# Altium project ELoad Control Assembly Gen 2 Rev 2.PrjPcb
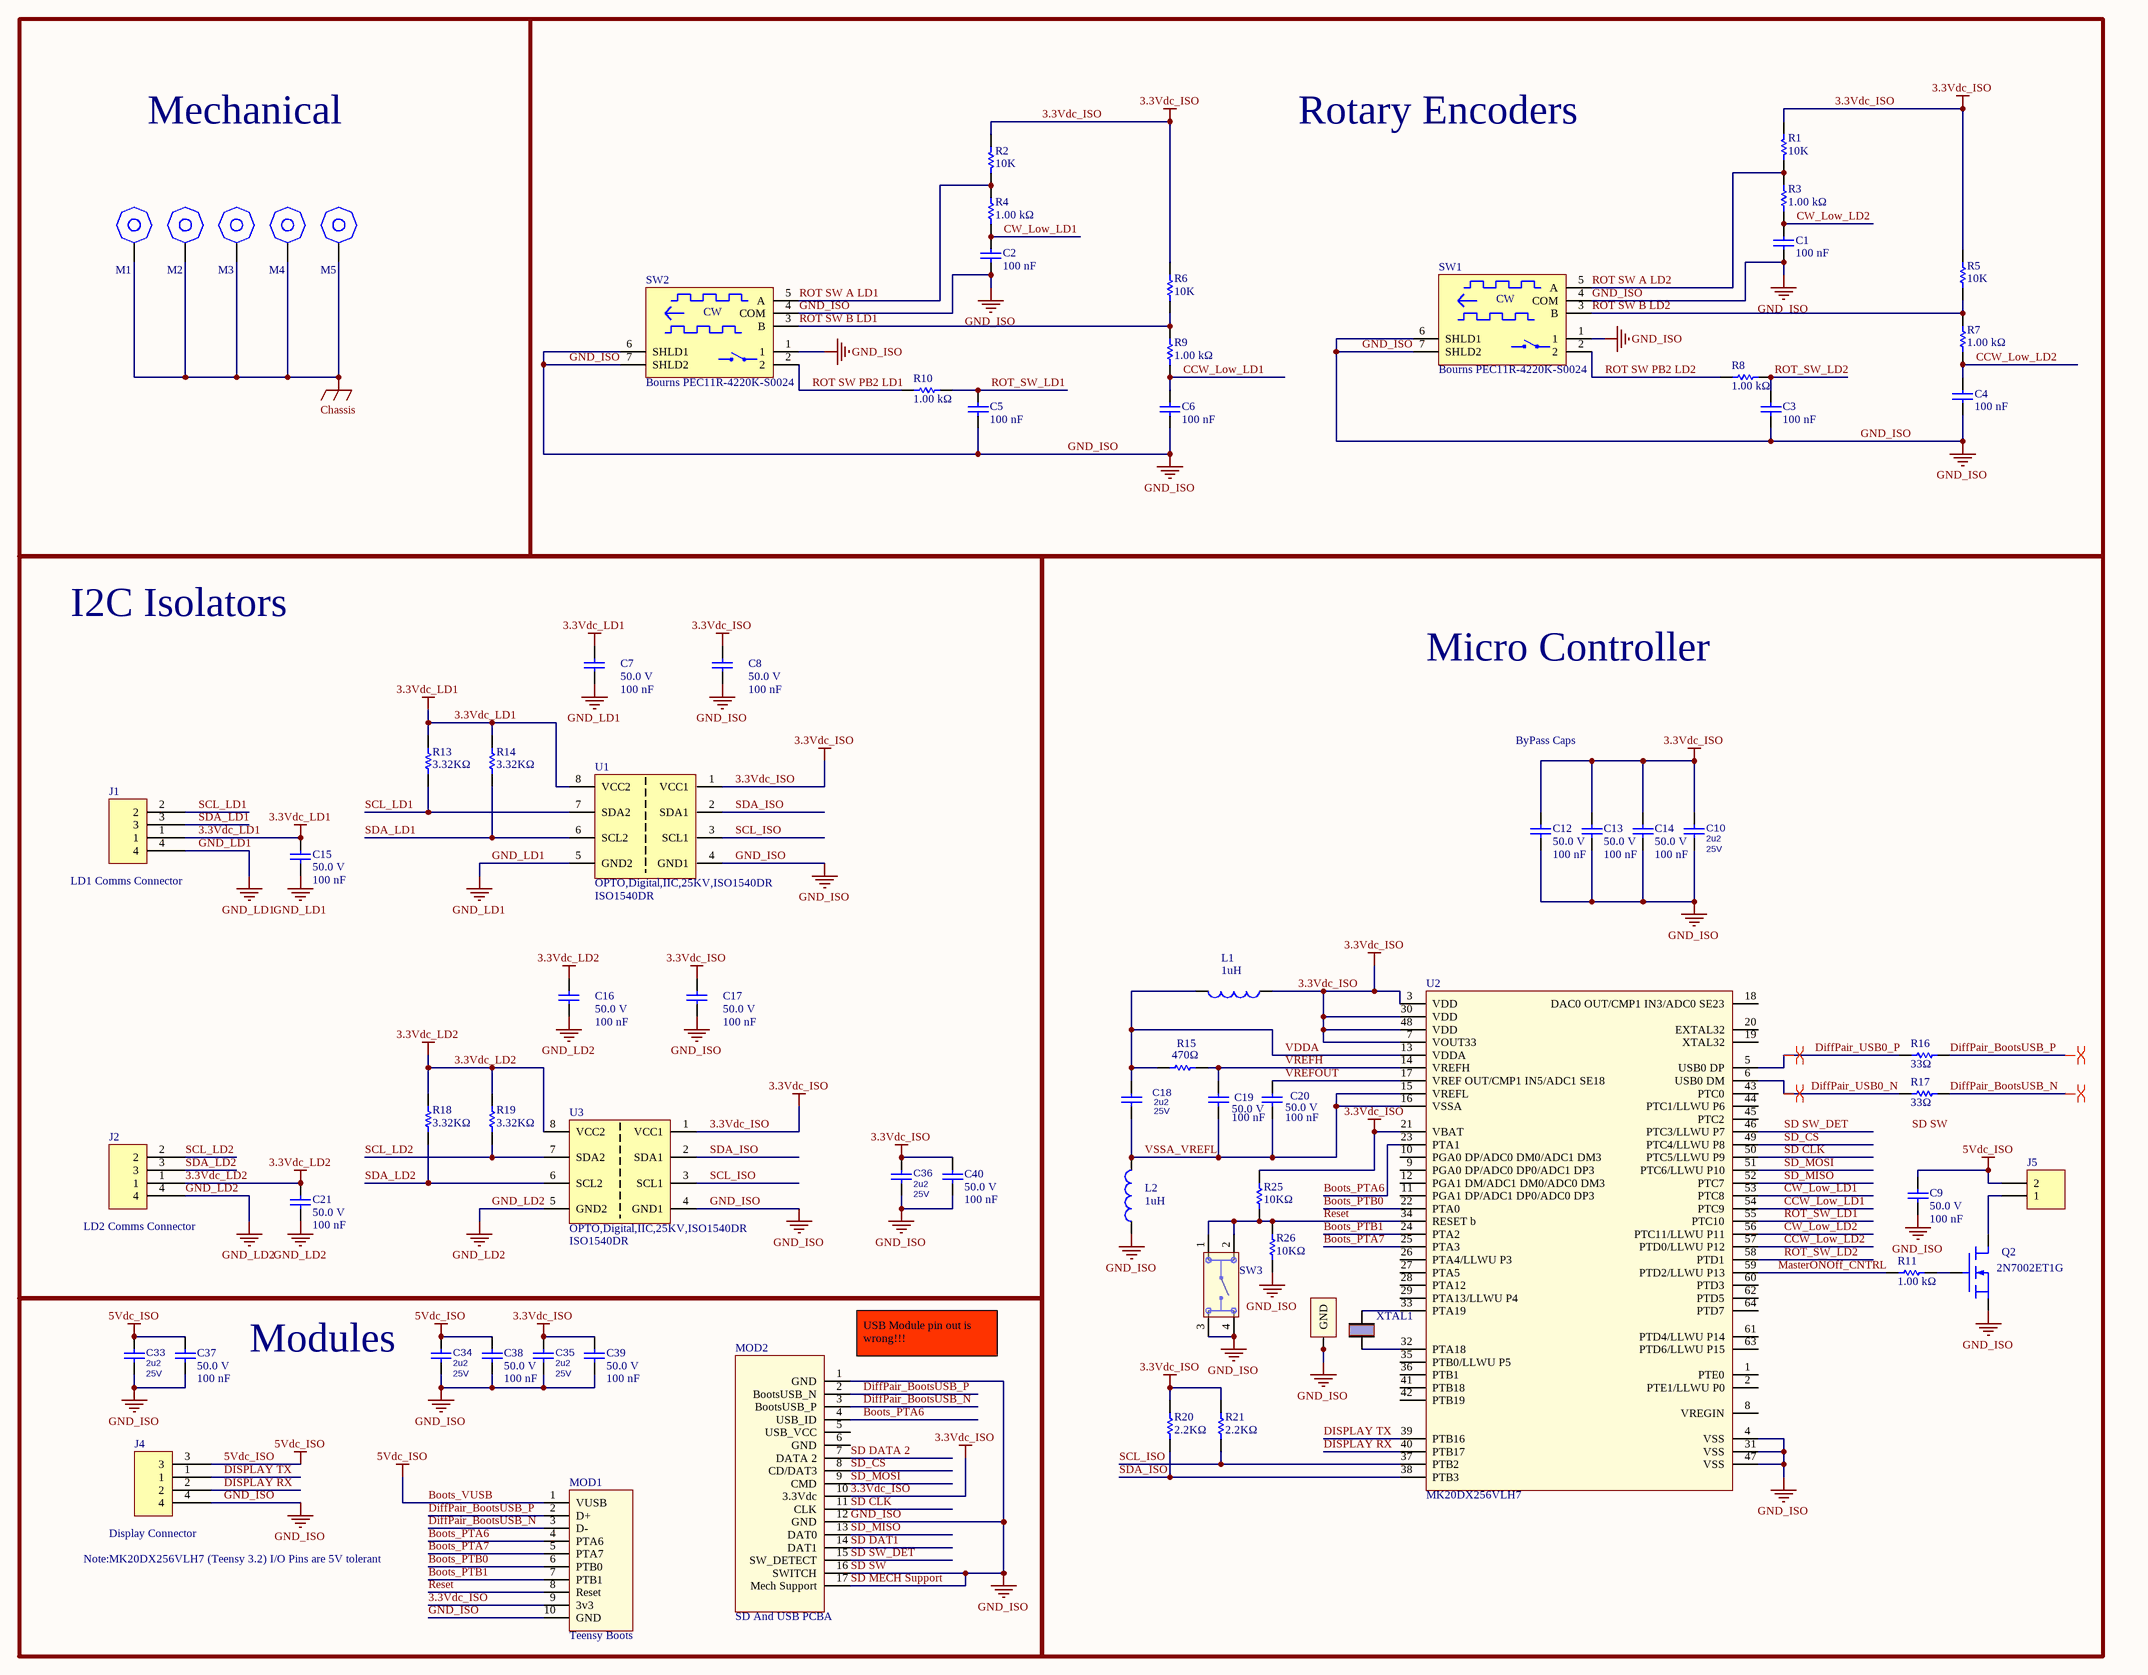
[diagram p0: ELoad Control Assembly Gen 2 - Rev 2.SchDoc]
3 sheets, 89 parts. Net scope: global (net labels, ports and power ports of the same name join across sheets).
Sheets:
  ELoad Control Assembly Gen 2 - Rev 2.SchDoc
  ELoad Control Assembly Gen 2 - Net Classes Rev 2.SchDoc
  ELoad Control Assembly Gen 2 - PSU - Rev 2.SchDoc

## Sheet ELoad Control Assembly Gen 2 - Rev 2.SchDoc
size C

### Parts
C1  Capacitance: 100 nF  [CAP, 0805, HD]  (hidden comment: 08055C104JAT2A)
C2  Capacitance: 100 nF  [CAP, 0805, HD]  (hidden comment: 08055C104JAT2A)
C3  Capacitance: 100 nF  [CAP, 0805, HD]  (hidden comment: 08055C104JAT2A)
C4  Capacitance: 100 nF  [CAP, 0805, HD]  (hidden comment: 08055C104JAT2A)
C5  Capacitance: 100 nF  [CAP, 0805, HD]  (hidden comment: 08055C104JAT2A)
C6  Capacitance: 100 nF  [CAP, 0805, HD]  (hidden comment: 08055C104JAT2A)
C7  Voltage Rating (DC): 50.0 V  Capacitance: 100 nF  [Cap,0805]  (hidden comment: Cap)
C8  Voltage Rating (DC): 50.0 V  Capacitance: 100 nF  [Cap,0805]  (hidden comment: Cap)
C9  Voltage Rating (DC): 50.0 V  Capacitance: 100 nF  [Cap,0805]  (hidden comment: Cap)
C10  2u2  Voltage: 25V  [CAP, 0805, HD]  (net tie)
C12  Voltage Rating (DC): 50.0 V  Capacitance: 100 nF  [Cap,0805]  (hidden comment: Cap)
C13  Voltage Rating (DC): 50.0 V  Capacitance: 100 nF  [Cap,0805]  (hidden comment: Cap)
C14  Voltage Rating (DC): 50.0 V  Capacitance: 100 nF  [Cap,0805]  (hidden comment: Cap)
C15  Voltage Rating (DC): 50.0 V  Capacitance: 100 nF  [Cap,0805]  (hidden comment: Cap)
C16  Voltage Rating (DC): 50.0 V  Capacitance: 100 nF  [Cap,0805]  (hidden comment: Cap)
C17  Voltage Rating (DC): 50.0 V  Capacitance: 100 nF  [Cap,0805]  (hidden comment: Cap)
C18  2u2  Voltage: 25V  [res, 0805, HD]  (net tie)
C19  Voltage Rating (DC): 50.0 V  Capacitance: 100 nF  [Cap,0805]  (hidden comment: Cap)
C20  Voltage Rating (DC): 50.0 V  Capacitance: 100 nF  [Cap,0805]  (hidden comment: Cap)
C21  Voltage Rating (DC): 50.0 V  Capacitance: 100 nF  [Cap,0805]  (hidden comment: Cap)
C33  2u2  Voltage: 25V  [CAP, 0805, HD]  (net tie)
C34  2u2  Voltage: 25V  [CAP, 0805, HD]  (net tie)
C35  2u2  Voltage: 25V  [CAP, 0805, HD]  (net tie)
C36  2u2  Voltage: 25V  [CAP, 0805, HD]  (net tie)
C37  Voltage Rating (DC): 50.0 V  Capacitance: 100 nF  [Cap,0805]  (hidden comment: Cap)
C38  Voltage Rating (DC): 50.0 V  Capacitance: 100 nF  [Cap,0805]  (hidden comment: Cap)
C39  Voltage Rating (DC): 50.0 V  Capacitance: 100 nF  [Cap,0805]  (hidden comment: Cap)
C40  Voltage Rating (DC): 50.0 V  Capacitance: 100 nF  [Cap,0805]  (hidden comment: Cap)
J1  JST B4B-PH-K-S(LF)(SN)  [Conn, JST, 4 pin, 2mm spacing Right Angle]  (value not drawn)
J2  JST B4B-PH-K-S(LF)(SN)  [Conn, JST, 4 pin, 2mm spacing Right Angle]  (value not drawn)
J4  JST B4B-PH-K-S(LF)(SN)  [Conn, JST, 4 pin, 2mm spacing Right Angle]  (value not drawn)
J5  conn, through hole, molex, 2 pin, 0.1",640456-2  [Conn, Molex, 2pin,0.1" spacing]  (value not drawn)
L1  Inductance: 1uH  [Ind, 0805]  (hidden comment: BK2125HM601-T)
L2  Inductance: 1uH  [Ind, 0805]  (hidden comment: BK2125HM601-T)
M1  M3 hex Standoff  [Standoff,Hex,M3,8mm]  (value not drawn)
M2  M3 hex Standoff  [Standoff,Hex,M3,8mm]  (value not drawn)
M3  M3 hex Standoff  [Standoff,Hex,M3,8mm]  (value not drawn)
M4  M3 hex Standoff  [Standoff,Hex,M3,8mm]  (value not drawn)
M5  M3 hex Standoff  [Standoff,Hex,M3,8mm]  (value not drawn)
MOD1  Teensy Boots  [Mod,Teensy Boots]
MOD2  Discription: SD And USB PCBA  [Mod, SD and USB Connector Breakout - duplicate]  (hidden comment: SD Card Connector Breakout)
Q2  2N7002ET1G  [SOT23-3]
R1  Resistance: 10K  [res, 0805, HD]  (hidden comment: Vishay / Dale CRCW080510K0FKTA)
R2  Resistance: 10K  [res, 0805, HD]  (hidden comment: Vishay / Dale CRCW080510K0FKTA)
R3  Resistance: 1.00 kΩ  [res, 0805, HD]  (hidden comment: Vishay CRCW08051K00JNEA)
R4  Resistance: 1.00 kΩ  [res, 0805, HD]  (hidden comment: Vishay CRCW08051K00JNEA)
R5  Resistance: 10K  [res, 0805, HD]  (hidden comment: Vishay / Dale CRCW080510K0FKTA)
R6  Resistance: 10K  [res, 0805, HD]  (hidden comment: Vishay / Dale CRCW080510K0FKTA)
R7  Resistance: 1.00 kΩ  [res, 0805, HD]  (hidden comment: Vishay CRCW08051K00JNEA)
R8  Resistance: 1.00 kΩ  [res, 0805, HD]  (hidden comment: Vishay CRCW08051K00JNEA)
R9  Resistance: 1.00 kΩ  [res, 0805, HD]  (hidden comment: Vishay CRCW08051K00JNEA)
R10  Resistance: 1.00 kΩ  [res, 0805, HD]  (hidden comment: Vishay CRCW08051K00JNEA)
R11  Resistance: 1.00 kΩ  [res, 0805, HD]  (hidden comment: Vishay CRCW08051K00JNEA)
R13  Resistance: 3.32KΩ  [res, 0805, HD]  (hidden comment: Res1)
R14  Resistance: 3.32KΩ  [res, 0805, HD]  (hidden comment: Res1)
R15  Resistance: 470Ω  [res, 0805, HD]  (hidden comment: Res1)
R16  Resistance: 33Ω  [res, 0805, HD]  (hidden comment: CR0805-JW-330ELF)
R17  Resistance: 33Ω  [res, 0805, HD]  (hidden comment: CR0805-JW-330ELF)
R18  Resistance: 3.32KΩ  [res, 0805, HD]  (hidden comment: Res1)
R19  Resistance: 3.32KΩ  [res, 0805, HD]  (hidden comment: Res1)
R20  Resistance: 2.2KΩ  [res, 0805, HD]  (hidden comment: Res1)
R21  Resistance: 2.2KΩ  [res, 0805, HD]  (hidden comment: Res1)
R25  Resistance: 10KΩ  [res, 0805, HD]  (hidden comment: Vishay / Dale CRCW080510K0FKTA)
R26  Resistance: 10KΩ  [res, 0805, HD]  (hidden comment: Vishay / Dale CRCW080510K0FKTA)
SW1  Bourns PEC11R-4220K-S0024  [Rotary encoder]
SW2  Bourns PEC11R-4220K-S0024  [Rotary encoder]
SW3  Switch, push button,N.O. DPST,SKRPACE010  [Switch Tactile N.O. SPST Button]  (value not drawn)
U1  OPTO,Digital,IIC,25KV,ISO1540DR  Manufacturer Part Number 1: ISO1540DR  [SOIC-8]
U2  MK20DX256VLH7  [LQFP-64]
U3  OPTO,Digital,IIC,25KV,ISO1540DR  Manufacturer Part Number 1: ISO1540DR  [SOIC-8]
XTAL1  NX3225SA-16.000000MHZ-B3  [CRYSTAL,4-SMD, No Lead]  (value not drawn)

### Blocks framed on the sheet
Mechanical: M1-M5
Rotary Encoders: C1-C6 R1-R10 SW1 SW2
I2C Isolators: C7 C8 C15-C17 C21 C36 C40 J1 J2 R13 R14 R18 R19 U1 U3
Micro Controller: C9 C10 C12-C14 C18-C20 J5 L1 L2 Q2 R11 R15-R17 R20 R21 R25 R26 SW3 U2 XTAL1
Modules: C33-C35 C37-C39 J4 MOD1 MOD2

### Nets
3.3Vdc_ISO: C8.2 C10.2 C12.2 C13.2 C14.2 C17.2 C35.2 C36.2 C39.2 C40.2 L1.1 MOD1.9(3v3) MOD2.10(3.3Vdc) R1.2 R2.2 R5.1 R6.1 R20.2 R21.2 R25.2 U1.1(VCC1) U2.3(VDD) U2.7(VOUT33) U2.21(VBAT) U2.30(VDD) U2.48(VDD) U3.1(VCC1)
3.3Vdc_LD1: C7.2 C15.2 J1.1 R13.2 R14.2 U1.8(VCC2)
3.3Vdc_LD2: C16.2 C21.2 J2.1 R18.2 R19.2 U3.8(VCC2)
5Vdc_ISO: C9.2 C33.2 C34.2 C37.2 C38.2 J4.3 J5.2 MOD1.1(VUSB)  [also labelled Boots_VUSB]
Chassis: M1.0 M2.0 M3.0 M4.0 M5.0
GND_ISO: C1.1 C2.1 C3.1 C4.1 C5.1 C6.1 C8.1 C9.1 C10.1 C12.1 C13.1 C14.1 C17.1 C33.1 C34.1 C35.1 C36.1 C37.1 C38.1 C39.1 C40.1 J4.4 L2.1 MOD1.10(GND) MOD2.1(GND) MOD2.12(GND) MOD2.16(SWITCH) MOD2.17(Mech_Support) Q2.2(S) R26.1 SW1.1 SW1.4(COM) SW1.6(SHLD1) SW1.7(SHLD2) SW2.1 SW2.4(COM) SW2.6(SHLD1) SW2.7(SHLD2) SW3.3 SW3.4 U1.4(GND1) U2.4(VSS) U2.31(VSS) U2.47(VSS) U3.4(GND1) XTAL1.2(GND) XTAL1.4  [also labelled SD MECH Support, SD SW]
GND_LD1: C7.1 C15.1 J1.4 U1.5(GND2)
GND_LD2: C16.1 C21.1 J2.4 U3.5(GND2)
Boots_PTA6: MOD1.4(PTA6) MOD2.4(USB_ID) U2.23(PTA1)
Boots_PTA7: MOD1.5(PTA7) U2.25(PTA3)
Boots_PTB0: MOD1.6(PTB0) U2.22(PTA0)
Boots_PTB1: MOD1.7(PTB1) U2.24(PTA2)
CCW_Low_LD1: C6.2 R9.2 U2.54(PTC9)
CCW_Low_LD2: C4.2 R7.2 U2.57(PTD0/LLWU_P12)
CW_Low_LD1: C2.2 R4.2 U2.53(PTC8)
CW_Low_LD2: C1.2 R3.2 U2.56(PTC11/LLWU_P11)
DiffPair_BootsUSB_N: MOD1.3(D-) MOD2.3(BootsUSB_P) R17.1
DiffPair_BootsUSB_P: MOD1.2(D+) MOD2.2(BootsUSB_N) R16.1
DiffPair_USB0_N: R17.2 U2.6(USB0_DM)
DiffPair_USB0_P: R16.2 U2.5(USB0_DP)
DISPLAY RX: J4.2 U2.40(PTB17)
DISPLAY TX: J4.1 U2.39(PTB16)
MasterO~{N}Off_CNTRL: R11.1 U2.59(PTD2/LLWU_P13)
Reset: MOD1.8(Reset) R25.1 R26.2 SW3.1 SW3.2 U2.34(RESET_b)
ROT SW A LD1: R2.1 R4.1 SW2.5(A)
ROT SW A LD2: R1.1 R3.1 SW1.5(A)
ROT SW B LD1: R6.2 R9.1 SW2.3(B)
ROT SW B LD2: R5.2 R7.1 SW1.3(B)
ROT SW PB2 LD1: R10.1 SW2.2
ROT SW PB2 LD2: R8.1 SW1.2
ROT_SW_LD1: C5.2 R10.2 U2.55(PTC10)
ROT_SW_LD2: C3.2 R8.2 U2.58(PTD1)
SCL_ISO: R21.1 U1.3(SCL1) U2.37(PTB2) U3.3(SCL1)
SCL_LD1: J1.2 R13.1 U1.7(SDA2)
SCL_LD2: J2.2 R19.1 U3.7(SDA2)
SD CLK: MOD2.11(CLK) U2.50(PTC5/LLWU_P9)
SD DAT1: MOD2.14(DAT1)
SD DATA 2: MOD2.7(DATA_2)
SD SW_DET: MOD2.15(SW_DETECT) U2.46(PTC3/LLWU_P7)
SD_CS: MOD2.8(CD/DAT3) U2.49(PTC4/LLWU_P8)
SD_MISO: MOD2.13(DAT0) U2.52(PTC7)
SD_MOSI: MOD2.9(CMD) U2.51(PTC6/LLWU_P10)
SDA_ISO: R20.1 U1.2(SDA1) U2.38(PTB3) U3.2(SDA1)
SDA_LD1: J1.3 R14.1 U1.6(SCL2)
SDA_LD2: J2.3 R18.1 U3.6(SCL2)
VDDA: C18.2 L1.2 R15.2 U2.13(VDDA)
VREFH: C19.2 R15.1 U2.14(VREFH)
VREFOUT: C20.2 U2.17(VREF_OUT/CMP1_IN5/ADC1_SE18)
VSSA_VREFL: C18.1 C19.1 C20.1 L2.2 U2.15(VREFL) U2.16(VSSA)
NetJ5_1: J5.1 Q2.3(D)
NetQ2_1: Q2.1(G) R11.2
NetU2_32: U2.32(PTA18) XTAL1.3
NetU2_33: U2.33(PTA19) XTAL1.1

Not connected (* = marked no-connect by the designer): MOD2 5(USB_VCC) 6(GND); U2 1(PTE0) 2(PTE1/LLWU_P0) 8(VREGIN) 9(PGA0_DP/ADC0_DP0/ADC1_DP3) 10(PGA0_DP/ADC0_DM0/ADC1_DM3) 11(PGA1_DP/ADC1_DP0/ADC0_DP3) 12(PGA1_DM/ADC1_DM0/ADC0_DM3) 18(DAC0_OUT/CMP1_IN3/ADC0_SE23) 19(XTAL32) 20(EXTAL32) 26(PTA4/LLWU_P3) 27(PTA5) 28(PTA12) 29(PTA13/LLWU_P4) 35(PTB0/LLWU_P5) 36(PTB1) 41(PTB18) 42(PTB19) 43(PTC0) 44(PTC1/LLWU_P6) 45(PTC2) 60(PTD3) 61(PTD4/LLWU_P14) 62(PTD5) 63(PTD6/LLWU_P15) 64(PTD7)

### Layout directives
differential pair: DiffPair_BootsUSB_N, DiffPair_BootsUSB_P, DiffPair_USB0_N, DiffPair_USB0_P

### Notes on the sheet
- ByPass Caps
- (near J1) LD1 Comms Connector
- (near J2) LD2 Comms Connector
- (near MOD2) USB Module pin out is wrong!!!
- (near J4) Display Connector
- Note:MK20DX256VLH7 (Teensy 3.2) I/O Pins are 5V tolerant
- Labels drawn without touching a wire or pin: SD SW
- (in symbol Rotary encoder, PEC11R-4220K-S0024) CW

### Library data of the parts
C1-C6 = Cap,0805,100nf,50V,5%,08055C104JAT2A: Capacitor; Ceramic; Cap 0.1 uF; Tol 5%; Vol-Rtg 50 VDC; SMT; 0805; X7R; Tape & Reel; Lead-Free Status: Lead Free; Voltage Rating (DC): 50.0 V; Case/Package (SI): 2012; Insulation Resistance: 100 GΩ; Detailed Description: 0.1µF ±5% 50V Ceramic Capacitor X7R 0805 (2012 Metric); Mounting Style: Surface Mount; Packaging: Tape & Reel (TR), Cut Tape (CT); RoHS: Compliant; Size-Width: 1.24 mm; Case/Package: 0805; Number of Pins: 2; digikey url: http://www.digikey.ca/product-detail/en/avx-corporation/08055C104JAT2A/478-3352-1-ND/930144; REACH SVHC Compliance: No SVHC; Dielectric Characteristic: X7R; Capacitance Tolerance: ±5%; Size-Length: 2.01 mm; Size-Height: 710 µm; Size-Thickness: 940 µm; Manufacturer Part Number: 08055C104JAT2A; Octopart URL: http://octopart.com/08055c104jat2a-avx-55388010; Operating Temperature: -55°C ~ 125°C
C7-C9 C12-C17 C19-C21 C37-C40 = Cap,0805,100nf,50V,5%,08055C104JAT2A: Capacitor; Ceramic; Cap 0.1 uF; Tol 5%; Vol-Rtg 50 VDC; SMT; 0805; X7R; Tape & Reel; Lead-Free Status: Lead Free; Case/Package (SI): 2012; Insulation Resistance: 100 GΩ; Detailed Description: 0.1µF ±5% 50V Ceramic Capacitor X7R 0805 (2012 Metric); Mounting Style: Surface Mount; Packaging: Tape & Reel (TR), Cut Tape (CT); RoHS: Compliant; Size-Width: 1.24 mm; Case/Package: 0805; Number of Pins: 2; digikey url: http://www.digikey.ca/product-detail/en/avx-corporation/08055C104JAT2A/478-3352-1-ND/930144; REACH SVHC Compliance: No SVHC; Dielectric Characteristic: X7R; Capacitance Tolerance: ±5%; Size-Length: 2.01 mm; Size-Height: 710 µm; Size-Thickness: 940 µm; Manufacturer Part Number: 08055C104JAT2A; Octopart URL: http://octopart.com/08055c104jat2a-avx-55388010; Operating Temperature: -55°C ~ 125°C
C10 C18 C33-C36 = Cap,0805,2.2uF,10%,25V: Cap,SMD,MLCC,2.2uF 25V X7R 10%,0805; Manufacturer: Murata; Manufacturer P/N: GRM21BR71E225KA73L (t&r, 3Kpcs); P/N: 211-121-19; iPS: 951-22501-R1; Not Stuffed: N/S; Temperature Category: -55~125 degC.; Fast Supplier: Digi-Key; Fast Supplier P/N: 490-3331-1-ND; Type: X7R
J1 J2 J4 = Conntector, though hole, JST, 4pin, 2mm,B4B-PH-K-S(LF)(SN): PH Series 4 Position 2 mm Pitch Through Hole Crimp Top Entry Shrouded Header; Voltage Rating (AC): 100 V; Insulation Resistance: 1.00 MΩ; Number of Contacts: 4; Contact Resistance: 10.0 mΩ; REACH SVHC Compliance: No SVHC; Mounting Style: Through Hole, Vertical; Manufacturer Part Number: B4B-PH-K-S(LF)(SN); Size-Width: 4.50 mm; Number of Positions: 4; Size-Height: 6.00 mm; Size-Length: 9.90 mm; Supplier 1: Farnell; Supplier 2: Newark; Supplier 3: Digi-Key
J5 = conn, through hole, molex, 2 pin, 0.1",640456-2: Header, Friction Lock; MTA-100; 2; 250 VAC; Polyester; Tin; Copper Alloy; Tin; Voltage Rating (AC): 250.0 V; Current Rating: 4.0 A; Pin Pitch: 0.00254 m; Shrouded: No; Number of Contacts: 2; Contact Plating: Tin; REACH SVHC Compliance: No SVHC; Packaging: Bag; Orientation: Vertical; Size-Length: 0.00508 m; Flammability Rating: UL 94 V-0; Size-Width: 0.005715 m; Number of Rows: 1; Supplier 1: Newark; Supplier 2: Farnell; Supplier 3: TME; Supplier 4: Allied; Supplier 5: Digi-Key; Supplier 6: Farnell; Supplier 7: Newark; Supplier 8: Allied; Supplier 9: Digi-Key; Supplier 10: Farnell; Supplier 11: Newark; Supplier 12: TME; Supplier 13: Digi-Key; Supplier Part Number 13: A1921-ND; Supplier 14: LCSC; Supplier Part Number 14: C86502
L1 L2 = Ind,0805,Ferrite Bead,600 Ohms @ 100MHz,BK2125HM601-T: FERRITE BEAD 600 OHM 0805 1LN; Manufacturer: Taiyo Yuden; Detailed Description: 600 Ohms @ 100MHz 1 Ferrite Bead 0805 (2012 Metric) 500mA 250mOhm; Categories: Filters   Ferrite Beads and Chips; Number of Lines: 1; Current Rating (Max): 500mA; DC Resistance (DCR) (Max): 250mOhm; mfg P/N: BK2125HM601-T; Series: BK; Packaging: Cut Tape (CT); Impedance @ Frequency: 600 Ohms @ 100MHz; Operating Temperature: -55°C ~ 125°C; Package / Case: 0805 (2012 Metric); Mounting Type: Surface Mount; Height (Max): 0.041" (1.05mm); Size / Dimension: 0.079" L x 0.049" W (2.00mm x 1.25mm)
M1-M5 = Mech,Standoff, M3, Hex: HEX STANDOFF M3,generic
MOD1 = Module,Teensy Boots,Programming
MOD2 = Mod,SD and USB breakout, Vertical
Q2 = MOSFET,N-Channel,SOT23,0.25A,60V,2N7002ET1G: Small Signal MOSFET, 60 V, 310 mA, Single, N-Channel, 3-Pin SOT-23, Pb-Free, Tape and Reel; Manufacturer: ON Semiconductor; Continuous Drain Current (Ids): 0.25A; Lead-Free Status: Lead Free; Drain to Source Voltage (Vds): 60.0 V; Power Dissipation (Max): 350mW (Ta); REACH SVHC Compliance: No SVHC; Number of Pins: 3; Halogen Free Status: Halogen Free; Case/Package: SOT-23-3; Polarity: N-Channel; RoHS: Compliant; Lifecycle Status: Active; Supplier 1: Digi-Key; Supplier Part Number 1: 2N7002ET1GOSCT-ND; Supplier 2: LCSC; Supplier Part Number 2: C71533; Manufacturer Part Number: 2N7002ET1G
R1 R2 R5 R6 R25 R26 = Res,0805,10.0kΩ,1%,100 ppm,CRCW080510K0FKTA: RES SMD 10K OHM 1% 1/8W 0805; Temperature Coefficient: 100.0 ppm/C; Lead-Free Status: Contains Lead; Voltage Rating (DC): 150.0 V; Power Rating: 0.125 W; Case/Package (SI): 2012; Size-Width: 0.00125 m; Resistance Tolerance: 1%; Size-Length: 0.002 m; RoHS: Non-Compliant; Power Dissipation: 0.125 W; Number of Pins: 2; REACH SVHC Compliance: No SVHC; Size-Height: 0.00045 m; Case/Package: 0805; Mounting Style: Surface Mount
R3 R4 R7-R11 = Res,0805,1.00 kΩ,5%,200ppm,CRCW08051K00JNEA: Res Thick Film 0805 1K Ohm 5% 0.125W(1/8W) ±200ppm/C Molded SMD Automotive Paper T/R; Power Rating: 125 mW; Case/Package (SI): 2012; Lead-Free Status: Lead Free; Temperature Coefficient: 200 ppm/°C; Voltage Rating (DC): 150 V; Size-Width: 1.25 mm; Mounting Style: Surface Mount; REACH SVHC Compliance: No SVHC; Manufacturer Part Number: CRCW08051K00JNEA; Number of Pins: 2; Size-Height: 450 µm; Packaging: Tape & Reel (TR), Cut Tape (CT); RoHS: Compliant; Resistance Tolerance: ±5%; Case/Package: 0805; Size-Length: 2.00 mm
R13 R14 R18 R19 = Res,0805,3.32K,±1%,100.0 ppm/°C,150.0 V,CRCW08053K32FKEA: RES SMD 3.32K OHM 1% 1/8W 0805; Case/Package (SI): 2012; Lead-Free Status: Lead Free; Power Rating: 0.125 W; Voltage Rating (DC): 150.0 V; Case/Package: 0805; Mounting Style: Surface Mount; Number of Pins: 2; Octopart Url: https://octopart.com/crcw08053k32fkea-vishay-39436860; REACH SVHC Compliance: No SVHC; Resistance Tolerance: ±1%; RoHS: Compliant; Size-Height: 0.00045 m; Size-Length: 0.002 m; Size-Width: 0.00125 m; Temperature Coefficient: 100.0 ppm/°C; mfg P/N: CRCW08053K32FKEA
R15 = res,0805,470Ω,5%,200ppm,CR0805-JW-471ELF: RES SMD 470 OHM 5% 1/8W 0805; Manufacturer: Bourns Inc.; Detailed Description: 470 Ohms ±5% 0.125W, 1/8W Chip Resistor 0805 (2012 Metric) Moisture Resistant Thick Film; Categories: Resistors   Chip Resistor - Surface Mount; Power (Watts): 0.125W, 1/8W; Temperature Coefficient: ±200ppm/°C; mfg P/N: CR0805-JW-471ELF; Part Status: Active; Tolerance: ±5%; Composition: Thick Film; Features: Moisture Resistant; Operating Temperature: -55°C ~ 155°C; Package / Case: 0805 (2012 Metric); Supplier Device Package: 0805; Size / Dimension: 0.079" L x 0.049" W (2.00mm x 1.25mm); Height - Seated (Max): 0.024" (0.60mm); Number of Terminations: 2; Base Part Number: CR0805
R16 R17 = Res,0805,33Ω,±5%,200ppm,CR0805-JW-330ELF: RES SMD 33 OHM 5% 1/8W 0805; Manufacturer: Bourns Inc.; Detailed Description: 33 Ohms ±5% 0.125W, 1/8W Chip Resistor 0805 (2012 Metric) Moisture Resistant Thick Film; Categories: Resistors   Chip Resistor - Surface Mount; Power (Watts): 0.125W, 1/8W; Temperature Coefficient: ±200ppm/°C; mfg P/N: CR0805-JW-330ELF; Series: CR0805; Part Status: Active; Tolerance: ±5%; Composition: Thick Film; Features: Moisture Resistant; Operating Temperature: -55°C ~ 155°C; Package / Case: 0805 (2012 Metric); Supplier Device Package: 0805; Size / Dimension: 0.079" L x 0.049" W (2.00mm x 1.25mm); Height - Seated (Max): 0.024" (0.60mm); Number of Terminations: 2; Base Part Number: CR0805
R20 R21 = Res,0805,2.2KΩ,±1%,100.0 ppm/°C,150.0 V,CRCW08052K20FKEA: RES SMD 2.2K OHM 1% 1/8W 0805; Case/Package (SI): 2012; Lead-Free Status: Lead Free; Power Rating: 0.125 W; Voltage Rating (DC): 150.0 V; Case/Package: 0805; Mounting Style: Surface Mount; Number of Pins: 2; Octopart Url: https://octopart.com/crcw08052k20fkea-vishay-39783534; REACH SVHC Compliance: No SVHC; Resistance Tolerance: ±1%; RoHS: Compliant; Size-Height: 0.00045 m; Size-Length: 0.002 m; Size-Width: 0.00125 m; Temperature Coefficient: 100.0 ppm/°C; mfg P/N: CRCW08052K20FKEA
SW1 SW2 = Rotary encoder, PEC11R-4220K-S0024: 24 Pulse Incremental Mechanical Rotary Encoder w/ 6 mm Knurl Shaft, Through Hole; Size-Width: 12.5 mm; RoHS: Compliant
SW3 = Switch, push button,N.O. DPST,SKRPACE010: Switch Tactile N.O. SPST Button J-Bend 0.05A 16VDC 2.55N SMD Automotive T/R; Switch Function:: ON - OFF; Current Rating:: 50mA; Mounting Style: Surface Mount; Voltage Rating DC:: 16VDC; Contact Form:: DPST; mfg P/N: SKRPACE010
U1 U3 = OPTO,Digital,IIC,25KV,ISO1540DR: DGTL ISO 2.5KV 2CH I2C 8SOIC; Manufacturer 1: Texas Instruments; Number of Channels: 2; Data Rate: 1Mbps; Min Supply Voltage: 3V; Max Supply Voltage: 5.5V; Nominal Supply Current: 3.6mA; Channel Type: Bidirectional; Propagation Delay: 70ns; Isolated Power: No; Pulse Width Distortion (PWD): 21ns; Working Voltage: 566V; Supplier 1: Digi-Key; Stock 1: 33237; Pricing 1: 1=4.80000, 10=4.31400, 100=3.53500, 500=3.00924, 1000=2.53792 (USD); RoHS: Yes; Mount: Surface Mount; Case/Package: SOIC; Number of Pins: 8; Min Operating Temperature: -40°C; Max Operating Temperature: 125°C; Packaging: Tape and Reel; Package Quantity: 1; REACH SVHC: No SVHC; Lead Free: Lead Free; ComponentLink1URL: https://datasheet.ciiva.com/6579/iso1540-6579723.pdf?src-supplier=Digi-Key; ComponentLink1Description: https://datasheet.ciiva.com/6579/iso1540-6579723.pdf?src-supplier=Digi-Key; ComponentLink2URL: https://datasheet.ciiva.com/6579/iso1540-6579724.pdf?src-supplier=Digi-Key; ComponentLink2Description: https://datasheet.ciiva.com/6579/iso1540-6579724.pdf?src-supplier=Digi-Key; ComponentLink3URL: https://datasheet.ciiva.com/6579/iso1540-6579725.pdf?src-supplier=Digi-Key; ComponentLink3Description: https://datasheet.ciiva.com/6579/iso1540-6579725.pdf?src-supplier=Digi-Key; ComponentLink4URL: https://datasheet.ciiva.com/14196/iso1540-14196749.pdf?src-supplier=Avnet; ComponentLink4Description: https://datasheet.ciiva.com/14196/iso1540-14196749.pdf?src-supplier=Avnet; Supplier Part Number 1: 296-34871-1-ND
U2 = Micro,72Mhz,32-Bit,256Kmem,Teensy3.2,MK20DX256VLH7: ARM Cortex-M4 Kinetis K20 Microcontroller IC 32-Bit 72MHz 256KB (256K x 8) FLASH 64-LQFP (10x10); Manufacturer: NXP; Mfg Package Ident: 98ASS23234W; Num Pins: 64; Package: 98ASS23234W; Supplier 2: Mouser; Price: 4.78551472277; Supplier 1: Digi-Key; Supplier Part Number 1: MK20DX256VLH7-ND; RoHS: TRUE; Lead Free: yes; mfg P/N: MK20DX256VLH7
XTAL1 = resonator,crystal,SMD,stab15ppm,Tol,10ppm,7.2pf,80ohms,NX3225SA-16.000000MHZ-B3: CRYSTAL 16.0000MHZ 7.2PF SMD; Manufacturer: NDK America, Inc.; Detailed Description: 16MHz ±10ppm Crystal 7.2pF 80 Ohms 4-SMD, No Lead; Frequency: 16MHz; Frequency Stability: ±15ppm; Frequency Tolerance: ±10ppm; ESR (Equivalent Series Resistance): 80 Ohms; Operating Mode: Fundamental; Categories: Crystals, Oscillators, Resonators   Crystals; mfg P/N: NX3225SA-16.000000MHZ-B3; Series: NX3225SA; Part Status: Active; Type: MHz Crystal; Load Capacitance: 7.2pF; Operating Temperature: -30°C ~ 85°C; Mounting Type: Surface Mount; Package / Case: 4-SMD, No Lead; Size / Dimension: 0.126" L x 0.098" W (3.20mm x 2.50mm); Height - Seated (Max): 0.028" (0.70mm); Supplier 1: Digi-Key; Supplier Part Number 1: 644-1099-1-ND

## Sheet ELoad Control Assembly Gen 2 - Net Classes Rev 2.SchDoc
size C
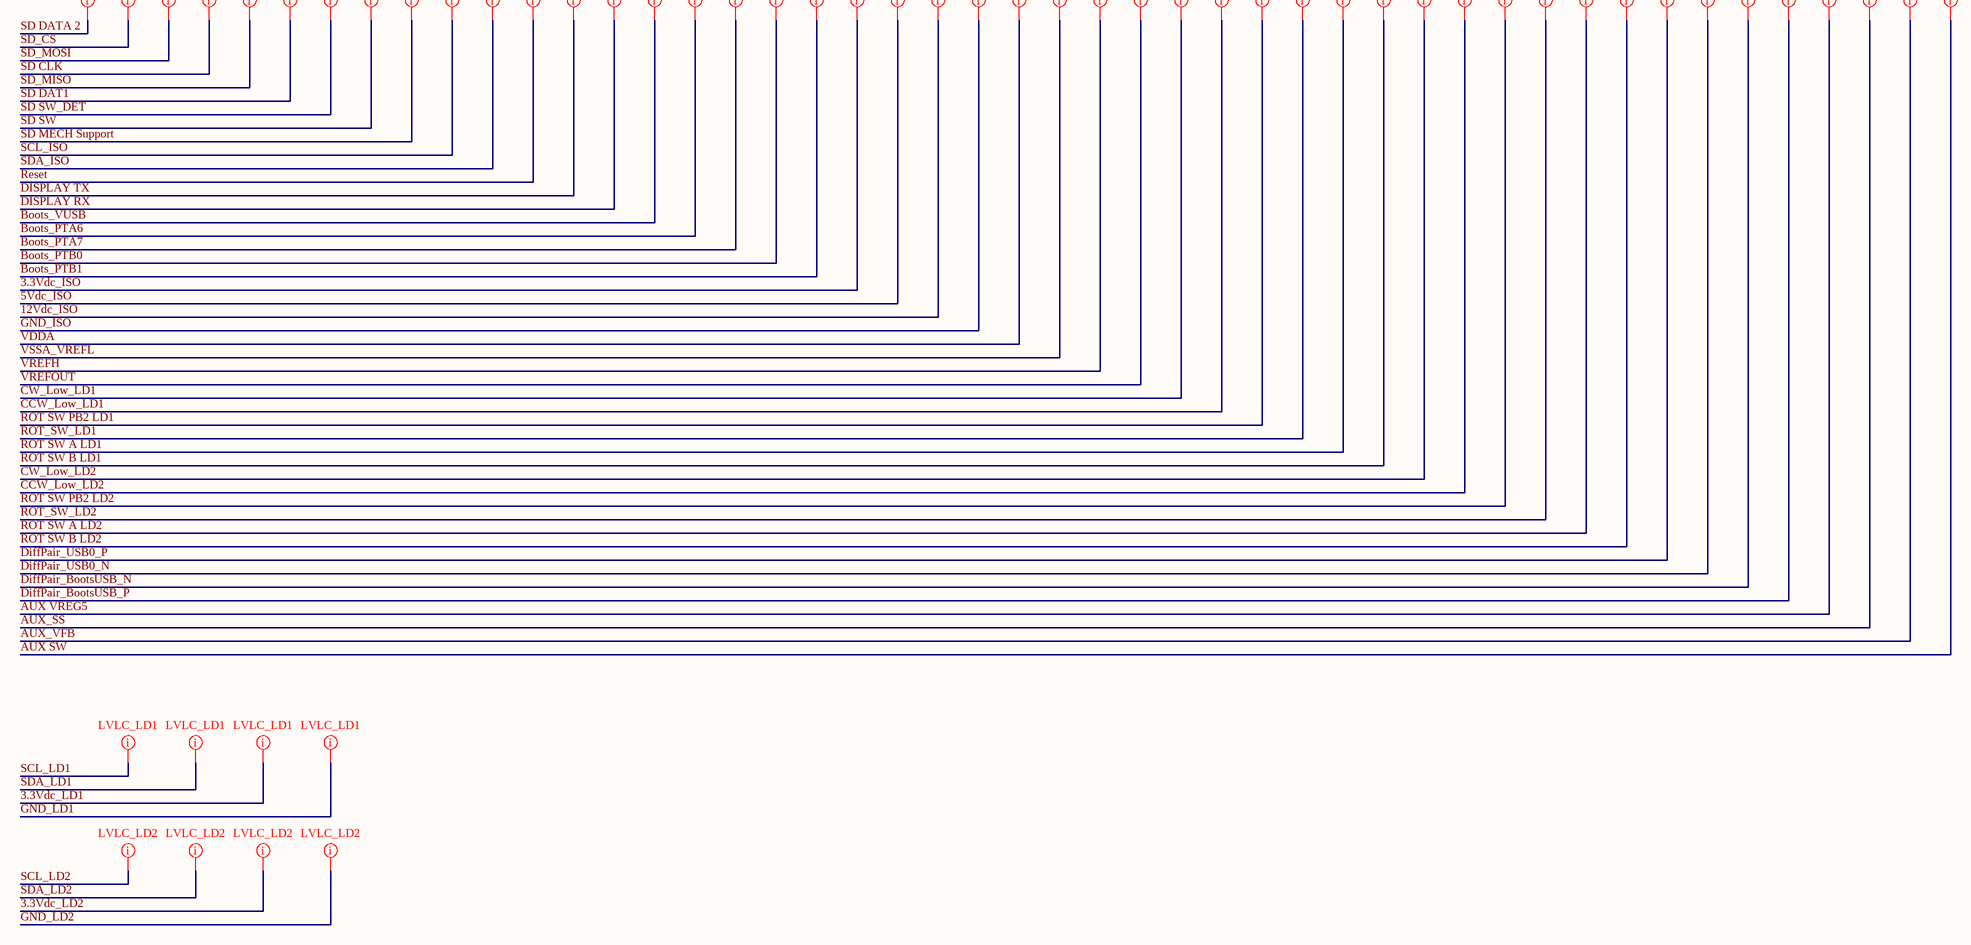
[diagram p1: ELoad Control Assembly Gen 2 - Net Classes Rev 2.SchDoc]

### Layout directives
net class Low Volt; net class Low Current: 3.3Vdc_ISO, 5Vdc_ISO, 12Vdc_ISO, AUX SW, AUX VREG5, AUX_SS, AUX_VFB, Boots_PTA6, Boots_PTA7, Boots_PTB0, Boots_PTB1, CCW_Low_LD1, CCW_Low_LD2, CW_Low_LD1, CW_Low_LD2, DISPLAY RX, DISPLAY TX, GND_ISO, Reset, ROT SW A LD1, ROT SW A LD2, ROT SW B LD1, ROT SW B LD2, ROT SW PB2 LD1, ROT SW PB2 LD2, ROT_SW_LD1, ROT_SW_LD2, SCL_ISO, SD CLK, SD DAT1, SD DATA 2, SD SW_DET, SD_CS, SD_MISO, SD_MOSI, SDA_ISO, VDDA, VREFH, VREFOUT, VSSA_VREFL
net class Low Volt; net class Low Current; net class HS_DiffPair: DiffPair_BootsUSB_N, DiffPair_BootsUSB_P, DiffPair_USB0_N, DiffPair_USB0_P
net class Low Volt LD1; net class Low Current: 3.3Vdc_LD1, GND_LD1, SCL_LD1, SDA_LD1
net class Low Volt LD2; net class Low Current: 3.3Vdc_LD2, GND_LD2, SCL_LD2, SDA_LD2

## Sheet ELoad Control Assembly Gen 2 - PSU - Rev 2.SchDoc
size B
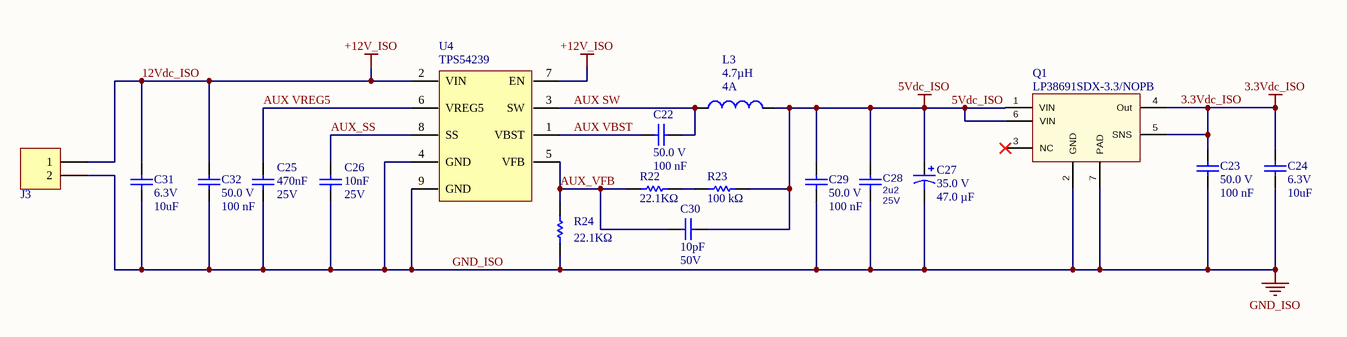
[diagram p2: ELoad Control Assembly Gen 2 - PSU - Rev 2.SchDoc]

### Parts
C22  Voltage Rating (DC): 50.0 V  Capacitance: 100 nF  [Cap,0805]  (hidden comment: Cap)
C23  Voltage Rating (DC): 50.0 V  Capacitance: 100 nF  [Cap,0805]  (hidden comment: Cap)
C24  Voltage - Rated: 6.3V  Capacitance: 10uF  [Cap,0805]  (hidden comment: Cap)
C25  Voltage Rating (DC): 25V  Capacitance: 470nF  [Cap,0805]  (hidden comment: Cap)
C26  Voltage Rating (DC): 25V  Capacitance: 10nF  [Cap,0805]  (hidden comment: Cap)
C27  Voltage Rating (DC): 35.0 V  Capacitance: 47.0 µF  [Cap, SMD, polerized, 5mm spacing]  (hidden comment: Nichicon UCW1V470MCL1GS)
C28  2u2  Voltage: 25V  [res, 0805, HD]  (net tie)
C29  Voltage Rating (DC): 50.0 V  Capacitance: 100 nF  [Cap,0805]  (hidden comment: Cap)
C30  Capacitance: 10pF  Voltage - Rated: 50V  [CAP, 0805, HD]  (hidden comment: CL21C100JBANNNC)
C31  Voltage - Rated: 6.3V  Capacitance: 10uF  [Cap,0805]  (hidden comment: Cap)
C32  Voltage Rating (DC): 50.0 V  Capacitance: 100 nF  [Cap,0805]  (hidden comment: Cap)
J3  conn, through hole, molex, 2 pin, 0.1",640456-2  [Conn, Molex, 2pin,0.1" spacing]  (value not drawn)
L3  Inductance: 4.7µH  Current Rating (Amps): 4A  [Ind,Non-Stand,Murata,1255AY]  (hidden comment: 1255AY-4R7M=P3)
Q1  LP38691SDX-3.3/NOPB  [6-WSON (3x3)]
R22  Resistance: 22.1KΩ  [res, 0805, HD]  (hidden comment: RC0805FR-0722K1L)
R23  Resistance: 100 kΩ  [res, 0805, HD]  (hidden comment: Res,0805,100kΩ,1%,100ppm,CRCW0805100KFKEA)
R24  Resistance: 22.1KΩ  [res, 0805, HD]  (hidden comment: RC0805FR-0722K1L)
U4  TPS54239  [SOIC-8 PowerPad(pin4)]

### Nets
3.3Vdc_ISO: C23.2 C24.2 Q1.4(Out) Q1.5(SNS)
5Vdc_ISO: C27.1 C28.2 C29.2 C30.1 L3.2 Q1.1(VIN) Q1.6(VIN) R23.1
12Vdc_ISO: C31.2 C32.2 J3.1 U4.2(VIN) U4.7(EN)  [also labelled +12V_ISO]
GND_ISO: C23.1 C24.1 C25.1 C26.1 C27.2 C28.1 C29.1 C31.1 C32.1 J3.2 Q1.2(GND) Q1.7(PAD) R24.1 U4.4(GND) U4.9(GND)
AUX SW: C22.1 L3.1 U4.3(SW)
AUX VBST: C22.2 U4.1(VBST)
AUX VREG5: C25.2 U4.6(VREG5)
AUX_SS: C26.2 U4.8(SS)
AUX_VFB: C30.2 R22.1 R24.2 U4.5(VFB)
NetR22_2: R22.2 R23.2

Not connected (* = marked no-connect by the designer): Q1 3(NC)*

### Library data of the parts
C22 C23 C29 C32 = Cap,0805,100nf,50V,5%,08055C104JAT2A: as C7 on sheet ELoad Control Assembly Gen 2 - Rev 2; Mounting Style: Surface Mount; Packaging: Tape & Reel (TR), Cut Tape (CT); RoHS: Compliant; Size-Width: 1.24 mm; Case/Package: 0805; Number of Pins: 2; digikey url: http://www.digikey.ca/product-detail/en/avx-corporation/08055C104JAT2A/478-3352-1-ND/930144; REACH SVHC Compliance: No SVHC; Dielectric Characteristic: X7R; Capacitance Tolerance: ±5%; Size-Length: 2.01 mm; Size-Height: 710 µm; Size-Thickness: 940 µm; Manufacturer Part Number: 08055C104JAT2A; Octopart URL: http://octopart.com/08055c104jat2a-avx-55388010; Operating Temperature: -55°C ~ 125°C
C24 C31 = Cap,0805,10uf,6.3V,10%,CL21A106KQFNNNG: CL21 Series 10 uF 6.3V ±10 % Tolerance X5R SMT Multilayer Ceramic Capacitor; Lead-Free Status: Lead Free; Tolerance: ±10%; Other Names: 1276-6457-2; RoHS: Compliant; mfg P/N: CL21A106KQFNNNG; Mounting Style: Surface Mount; Operating Temperature: -55°C ~ 85°C; Applications: General Purpose; Package / Case: 0805 (2012 Metric)
C25 = Cap,0805,470nf,25V,10%,CGA4J2X7R1E474K125AA: 0.47µF ±10% 25V Ceramic Capacitor X7R 0805 (2012 Metric); Manufacturer: TDK Corporation; Lead-Free Status: Lead Free; Case/Package (SI): 2012; Mounting Style: Surface Mount; Packaging: Tape & Reel (TR), Cut Tape (CT); RoHS: Compliant; Size-Width: 1.24 mm; Case/Package: 0805; Number of Pins: 2; REACH SVHC Compliance: No SVHC; Dielectric Characteristic: X7R; Capacitance Tolerance: ±10%; Size-Length: 2.01 mm; Size-Height: 710 µm; Size-Thickness: 940 µm; mfg P/N: CGA4J2X7R1E474K125AA; Ratings: AEC-Q200
C26 = Cap,0805,10nF,±10%,25Vdc: CAP CER 10000PF 25V X7R 0805; Manufacturer: Samsung Electro-Mechanics; Capacitance Tolerance: ±10%; Dielectric Material: Ceramic; Lead-Free Status: Lead Free; mfg P/N: C0805X102J1GACAUTO; Case/Package: 0805; Mounting Style: Surface Mount; REACH SVHC Compliance: No SVHC; RoHS: Compliant; Applications: General Purpose; Operating Temperature: -55°C ~ 125°C; Temperature Coefficient: X7R; Series: CL
C27 = Cap, Polar,SMD, 47uF,35V,UCW1V470MCL1GS: 47uF 35 V dc Aluminium Electrolytic Capacitor, CW Series 7000h 6.3(Dia.)x8.7mm; Capacitance Tolerance: ±20%; Octopart URL: http://octopart.com/ucw1v470mcl1gs-nichicon-19717421; Manufacturer Part Number: UCW1V470MCL1GS; Size-Height: 8.70 mm; RoHS: Compliant; Mounting Style: Surface Mount; Size-Diameter: 6.30 mm; OctopartID: d4591c7f2c120b9e
C28 = Cap,0805,2.2uF,10%,25V: as C10 on sheet ELoad Control Assembly Gen 2 - Rev 2; Fast Supplier: Digi-Key; Fast Supplier P/N: 490-3331-1-ND; Type: X7R
C30 = Cap,0805,10pf,±5%,C0G, NP0,CL21C100JBANNNC: CAP CER 10PF 50V C0G/NP0 0805; Manufacturer: Samsung Electro-Mechanics; Detailed Description: 10pF ±5% 50V Ceramic Capacitor C0G, NP0 0805 (2012 Metric); Categories: Capacitors   Ceramic Capacitors; Tolerance: ±5%; mfg P/N: CL21C100JBANNNC; Series: CL; Packaging: Tape & Reel (TR); Part Status: Active; Temperature Coefficient: C0G, NP0; Operating Temperature: -55°C ~ 125°C; Applications: General Purpose; Mounting Type: Surface Mount, MLCC; Package / Case: 0805 (2012 Metric); Size / Dimension: 0.079" L x 0.049" W (2.00mm x 1.25mm); Thickness (Max): 0.030" (0.75mm)
J3 = conn, through hole, molex, 2 pin, 0.1",640456-2: as J5 on sheet ELoad Control Assembly Gen 2 - Rev 2; Contact Plating: Tin; REACH SVHC Compliance: No SVHC; Packaging: Bag; Orientation: Vertical; Size-Length: 0.00508 m; Flammability Rating: UL 94 V-0; Size-Width: 0.005715 m; Number of Rows: 1; Supplier 1: Newark; Supplier 2: Farnell; Supplier 3: TME; Supplier 4: Allied; Supplier 5: Digi-Key; Supplier 6: Farnell; Supplier 7: Newark; Supplier 8: Allied; Supplier 9: Digi-Key; Supplier 10: Farnell; Supplier 11: Newark; Supplier 12: TME; Supplier 13: Digi-Key; Supplier Part Number 13: A1921-ND; Supplier 14: LCSC; Supplier Part Number 14: C86502
L3 = IND,NON-Stand,SMD,4.7uH,4.5A,27.6mOhm,1255AY-4R7M=P3: FIXED IND 4.7UH 4.5A 27.6 MOHM; Manufacturer: Murata Electronics North America; Detailed Description: 4.7µH Shielded Wirewound Inductor 4A 27.6mOhm Max Nonstandard; Type: Wirewound; Material - Core: Ferrite; Tolerance: ±20%; Shielding: Shielded; DC Resistance (DCR): 27.6mOhm Max; Inductance Frequency - Test: 100kHz; mfg P/N: 1255AY-4R7M=P3; Part Status: Active; Current - Saturation: 4.5A; Mounting Type: Surface Mount; Package / Case: Nonstandard; Size / Dimension: 0.248" L x 0.248" W (6.30mm x 6.30mm); Height - Seated (Max): 0.177" (4.50mm)
Q1 = Reg,Linear,Fixed,500mA,10Vin_Max,3.3Vdc,LP38691SD-ADJ/NOPB: IC REG LIN POS ADJ 500MA 6WSON; Manufacturer: Texas Instruments; Output: Configuration Positive; Output Type: Fixed; Number of Regulators: 1; Current - Quiescent: (Iq) 55µA; Current - Supply (Max): 100µA; Detailed Description: Linear Voltage Regulator IC 1 Output 500mA 6-WSON (3x3); Categories: Integrated Circuits (ICs)   PMIC - Voltage Regulators - Linear; Voltage - Input (Max): 10V; Voltage - Output (Min/Fixed): 3.3V; Voltage - Output (Max): 9V; PSRR: 55dB (120Hz); Protection Features: Over Temperature; Voltage Dropout (Max): 0.55V @ 500mA; Series: Automotive, AEC-Q100; Mounting Type: Surface Mount; Package / Case: 6-WDFN Exposed Pad; Supplier Device Package: 6-WSON (3x3); mfg P/N: LP38691SDX-3.3/NOPB; Part Status: Active; Current - Output: 500mA; Operating Temperature: -40°C ~ 125°C; Base Part Number: LP38691
R22 R24 = Res,0805,22.1K,1%,100ppm,RC0805FR-0722K1L: 22.1 kOhms ±1% 0.125W, 1/8W Chip Resistor 0805 (2012 Metric) Moisture Resistant Thick Film; Case/Package (SI): 2012; Temperature Coefficient: 100.0 ppm/°C; Voltage Rating (DC): 150.0 V; Case/Package: 0805; Mounting Style: Surface Mount; Number of Pins: 2; Power Rating: 0.125 W; Resistance Tolerance: ±1%; Size-Height: 0.00045 m; Size-Length: 0.002 m; Size-Width: 0.00125 m; Features: Moisture Resistant; Operating Temperature: -55°C ~ 155°C
R23 = Res,0805,100kΩ,1%,100ppm,CRCW0805100KFKEA: 100 kOhms ±1% 0.125W, 1/8W Chip Resistor 0805 (2012 Metric) Thick Film; Manufacturer: Vishay; Lead-Free Status: Lead Free; Case/Package (SI): 2012; Power Rating: 125 mW; Temperature Coefficient: -100 ppm/°C to 100 ppm/°C; Resistance Tolerance: ±1%; RoHS: Compliant; Manufacturer Part Number: CRCW0805100KFKEA; Number of Pins: 2; Size-Length: 2.00 mm; Packaging: Tape & Reel (TR), Reel, Cut Tape (CT); Size-Height: 450 µm; Case/Package: 0805; Size-Width: 1.25 mm; Operating Temperature: 150 °C (max); Supplier 1 Part Number: 679-0803; Supplier 1: RS
U4 = Reg, Switching, Buck,23-4.5Vdcin,2A,TPS54239EDDAR: Buck Switching Regulator IC Positive Adjustable 0.76V 1 Output 2A 8-PowerSOIC (0.154", 3.90mm Width); Function: Step-Down; Number of Outputs: 1; Voltage - Input (Min): 4.5V; Voltage - Input (Max): 23V; Voltage - Output (Max): 7V; Frequency - Switching: 600kHz; Synchronous Rectifier: Yes; mfg P/N: TPS54239EDDAR; Output Configuration: Positive; Topology: Buck; Output Type: Adjustable; Voltage - Output (Min/Fixed): 0.76V; Current - Output: 2A; Operating Temperature: -40°C ~ 85°C (TA); Mounting Type: Surface Mount; Package / Case: 8-PowerSOIC (0.154", 3.90mm Width); Supplier Device Package: 8-SO PowerPad; Base Part Number: TPS54239

## Nets that join several sheets
3.3Vdc_ISO: ELoad Control Assembly Gen 2 - Rev 2 (27 pins), ELoad Control Assembly Gen 2 - PSU - Rev 2 (C23.2 C24.2 Q1.4 Q1.5)
5Vdc_ISO: ELoad Control Assembly Gen 2 - Rev 2 (8 pins), ELoad Control Assembly Gen 2 - PSU - Rev 2 (8 pins)
GND_ISO: ELoad Control Assembly Gen 2 - Rev 2 (47 pins), ELoad Control Assembly Gen 2 - PSU - Rev 2 (15 pins)